# EAGLE design simhid-g1000_right (EAGLE 9.6.2)
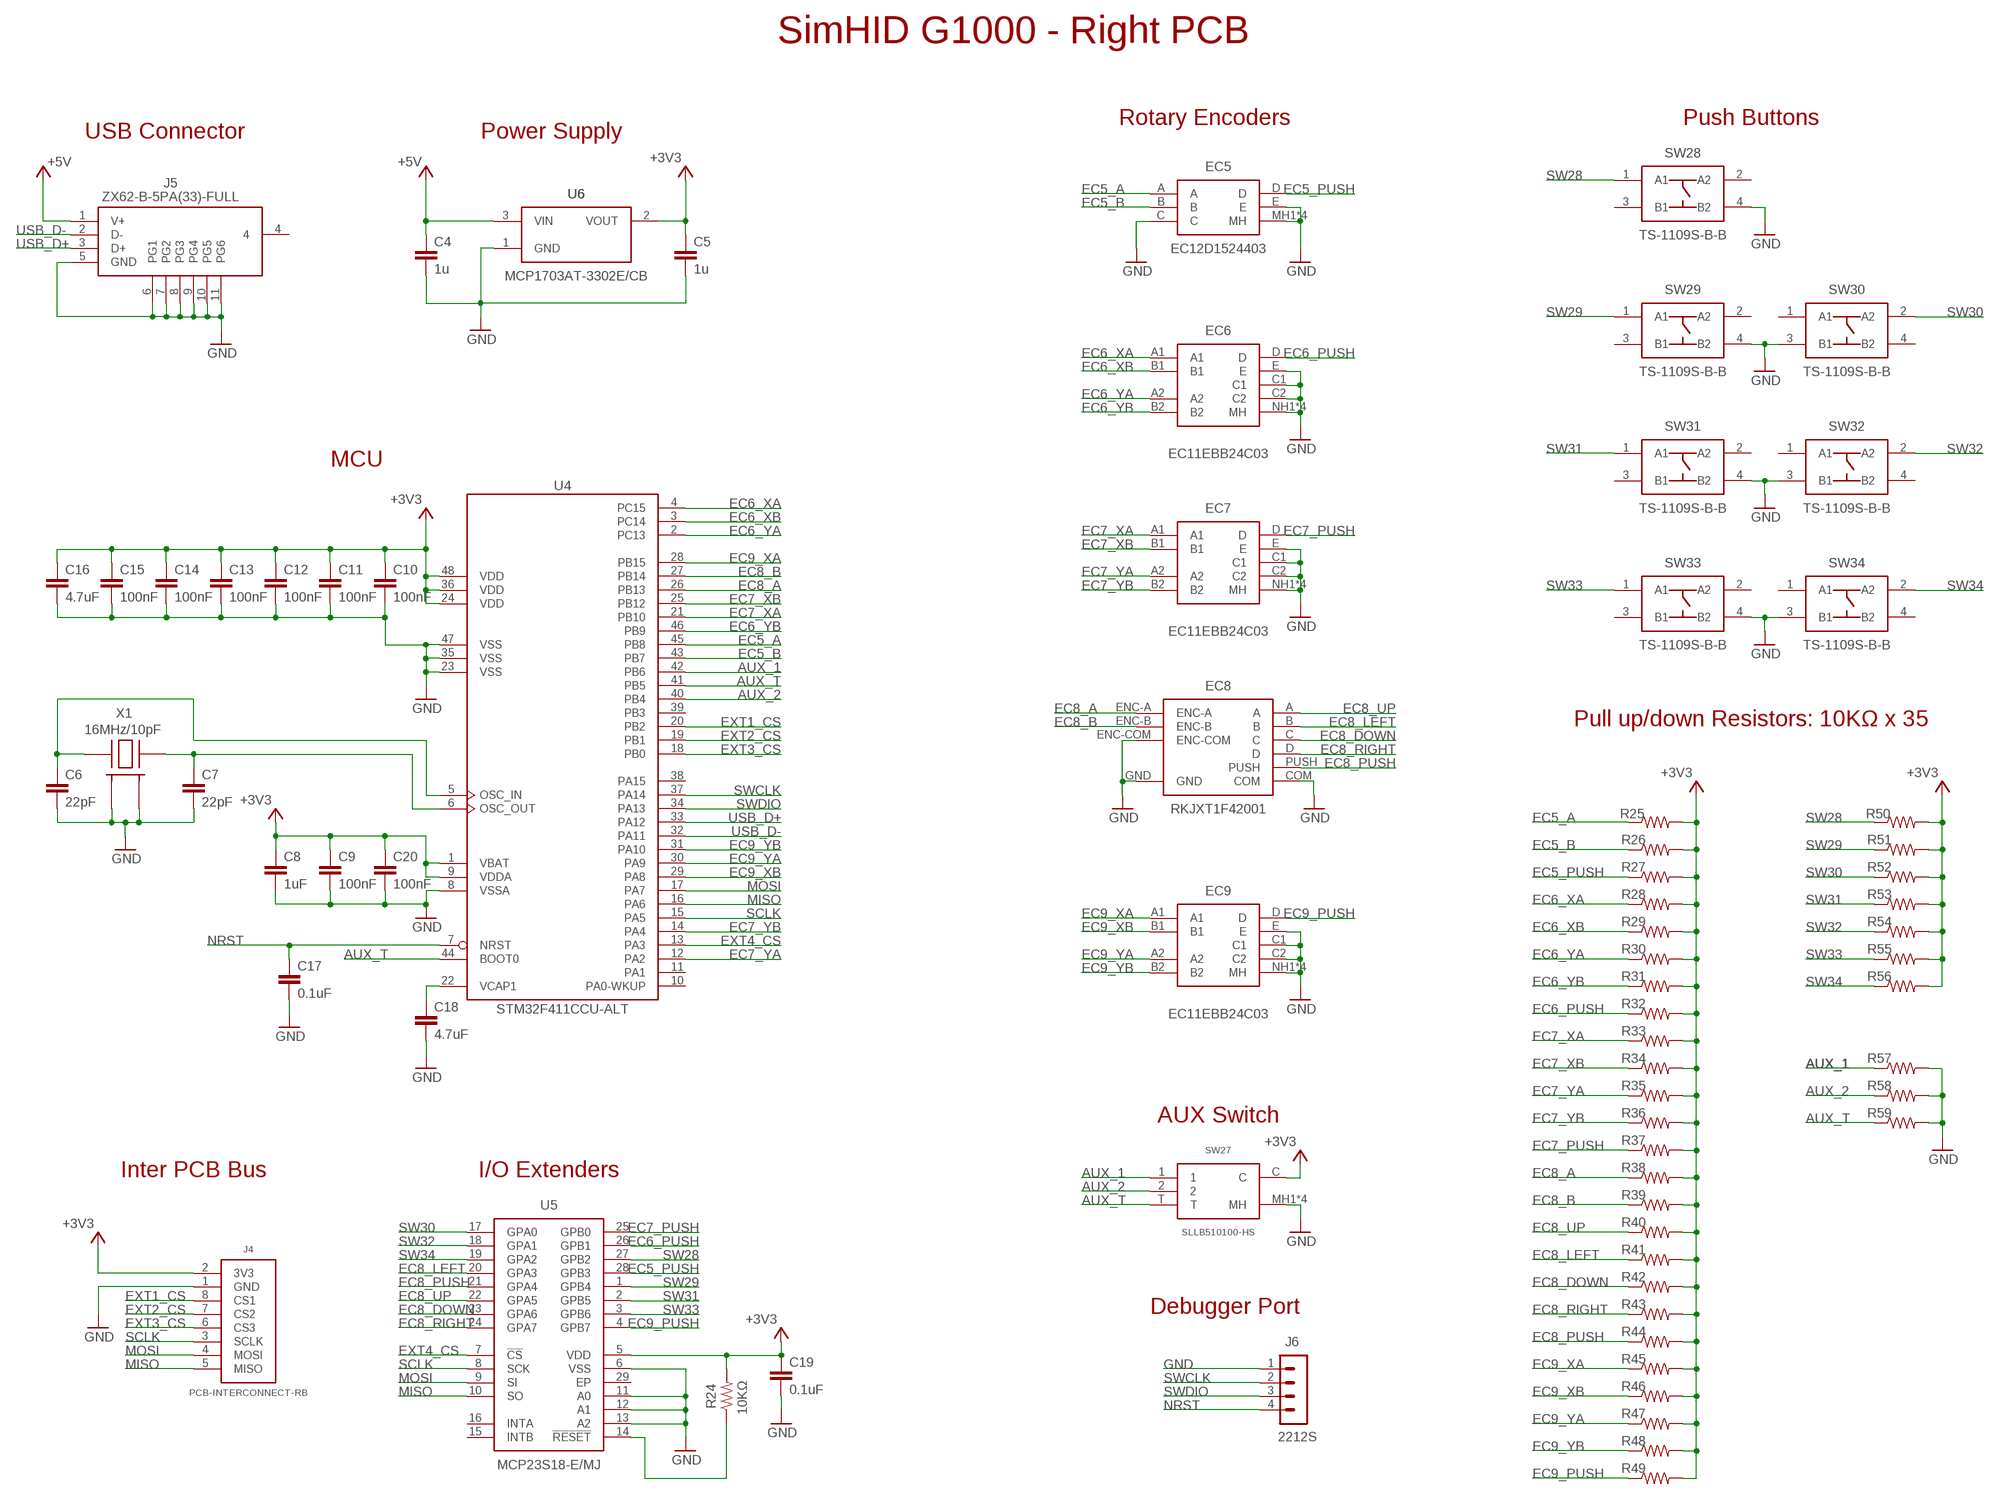
[diagram p0: schematic, sheet 1]

## Parts
C4  1u  RCL_C-EUC0402-HS  [RCL_C0402_HS]
C5  1u  RCL_C-EUC0402-HS  [RCL_C0402_HS]
C6  22pF  RCL_C-EUC0402-HS  [RCL_C0402_HS]
C7  22pF  RCL_C-EUC0402-HS  [RCL_C0402_HS]
C8  1uF  RCL_C-EUC0402-HS  [RCL_C0402_HS]
C9  100nF  RCL_C-EUC0402-HS  [RCL_C0402_HS]
C10  100nF  RCL_C-EUC0402-HS  [RCL_C0402_HS]
C11  100nF  RCL_C-EUC0402-HS  [RCL_C0402_HS]
C12  100nF  RCL_C-EUC0402-HS  [RCL_C0402_HS]
C13  100nF  RCL_C-EUC0402-HS  [RCL_C0402_HS]
C14  100nF  RCL_C-EUC0402-HS  [RCL_C0402_HS]
C15  100nF  RCL_C-EUC0402-HS  [RCL_C0402_HS]
C16  4.7uF  RCL_C-EUC0402-HS  [RCL_C0402_HS]
C17  0.1uF  RCL_C-EUC0402-HS  [RCL_C0402_HS]
C18  4.7uF  RCL_C-EUC0402-HS  [RCL_C0402_HS]
C19  0.1uF  RCL_C-EUC0402-HS  [RCL_C0402_HS]
C20  100nF  RCL_C-EUC0402-HS  [RCL_C0402_HS]
EC5  EC12D1524403  [EC12D1524403]
EC6  EC11EBB24C03  [EC11EBB24C03]
EC7  EC11EBB24C03  [EC11EBB24C03]
EC8  RKJXT1F42001  [RKJXT1F42001]
EC9  EC11EBB24C03  [EC11EBB24C03]
J4  PCB-INTERCONNECT-RB  [PCB-INTERCONNECT-R]
J5  ZX62-B-5PA(33)-FULL  [ZX62-B-5PA(33)-TRUE-HANDSOLD]
J6  2212S  53047-0410  [53047-0410]
R24  10KΩ  RCL_R-US_R0402-HS  [RCL_R0402_HS]
R25  RCL_R-US_R0402-HS  [RCL_R0402_HS]
R26  RCL_R-US_R0402-HS  [RCL_R0402_HS]
R27  RCL_R-US_R0402-HS  [RCL_R0402_HS]
R28  RCL_R-US_R0402-HS  [RCL_R0402_HS]
R29  RCL_R-US_R0402-HS  [RCL_R0402_HS]
R30  RCL_R-US_R0402-HS  [RCL_R0402_HS]
R31  RCL_R-US_R0402-HS  [RCL_R0402_HS]
R32  RCL_R-US_R0402-HS  [RCL_R0402_HS]
R33  RCL_R-US_R0402-HS  [RCL_R0402_HS]
R34  RCL_R-US_R0402-HS  [RCL_R0402_HS]
R35  RCL_R-US_R0402-HS  [RCL_R0402_HS]
R36  RCL_R-US_R0402-HS  [RCL_R0402_HS]
R37  RCL_R-US_R0402-HS  [RCL_R0402_HS]
R38  RCL_R-US_R0402-HS  [RCL_R0402_HS]
R39  RCL_R-US_R0402-HS  [RCL_R0402_HS]
R40  RCL_R-US_R0402-HS  [RCL_R0402_HS]
R41  RCL_R-US_R0402-HS  [RCL_R0402_HS]
R42  RCL_R-US_R0402-HS  [RCL_R0402_HS]
R43  RCL_R-US_R0402-HS  [RCL_R0402_HS]
R44  RCL_R-US_R0402-HS  [RCL_R0402_HS]
R45  RCL_R-US_R0402-HS  [RCL_R0402_HS]
R46  RCL_R-US_R0402-HS  [RCL_R0402_HS]
R47  RCL_R-US_R0402-HS  [RCL_R0402_HS]
R48  RCL_R-US_R0402-HS  [RCL_R0402_HS]
R49  RCL_R-US_R0402-HS  [RCL_R0402_HS]
R50  RCL_R-US_R0402-HS  [RCL_R0402_HS]
R51  RCL_R-US_R0402-HS  [RCL_R0402_HS]
R52  RCL_R-US_R0402-HS  [RCL_R0402_HS]
R53  RCL_R-US_R0402-HS  [RCL_R0402_HS]
R54  RCL_R-US_R0402-HS  [RCL_R0402_HS]
R55  RCL_R-US_R0402-HS  [RCL_R0402_HS]
R56  RCL_R-US_R0402-HS  [RCL_R0402_HS]
R57  RCL_R-US_R0402-HS  [RCL_R0402_HS]
R58  RCL_R-US_R0402-HS  [RCL_R0402_HS]
R59  RCL_R-US_R0402-HS  [RCL_R0402_HS]
SW27  SLLB510100-HS  [SLLB510100-HS]
SW28  TS-1109S-B-B  [TS-1109S-B-B]
SW29  TS-1109S-B-B  [TS-1109S-B-B]
SW30  TS-1109S-B-B  [TS-1109S-B-B]
SW31  TS-1109S-B-B  [TS-1109S-B-B]
SW32  TS-1109S-B-B  [TS-1109S-B-B]
SW33  TS-1109S-B-B  [TS-1109S-B-B]
SW34  TS-1109S-B-B  [TS-1109S-B-B]
U4  STM32F411CCU-ALT  [UFQFPN48-2]
U5  MCP23S18-E/MJ  MCP23S17-E_ML  [QFN65P600X600X100-29N]
U6  MCP1703AT-3302E/CB  LDO-REGULATOR  [SOT23]
X1  16MHz/10pF  CRYSTAL3225HS  [CRYSTAL3225-HS]

## Nets
+3V3 [pwr]: C5.1 C8.1 C9.1 C10.1 C11.1 C12.1 C13.1 C14.1 C15.1 C16.1 C19.1 C20.1 J4.2(3V3) R24.2 R25.2 R26.2 R27.2 R28.2 R29.2 R30.2 R31.2 R32.2 R33.2 R34.2 R35.2 R36.2 R37.2 R38.2 R39.2 R40.2 R41.2 R42.2 R43.2 R44.2 R45.2 R46.2 R47.2 R48.2 R49.2 R50.2 R51.2 R52.2 R53.2 R54.2 R55.2 R56.2 SW27.C U4.1(VBAT) U4.9(VDDA) U4.24(VDD) U4.36(VDD) U4.48(VDD) U5.5(VDD) U6.2(VOUT)
+5V [pwr]: C4.1 J5.1(V+) U6.3(VIN)
AUX_1: R57.1 SW27.1 U4.42(PB6)
AUX_2: R58.1 SW27.2 U4.40(PB4)
AUX_T: R59.1 SW27.T U4.41(PB5) U4.44(BOOT0)
EC5_A: EC5.A R25.1 U4.45(PB8)
EC5_B: EC5.B R26.1 U4.43(PB7)
EC5_PUSH: EC5.D R27.1 U5.28(GPB3)
EC6_PUSH: EC6.D R32.1 U5.26(GPB1)
EC6_XA: EC6.A1 R28.1 U4.4(PC15)
EC6_XB: EC6.B1 R29.1 U4.3(PC14)
EC6_YA: EC6.A2 R30.1 U4.2(PC13)
EC6_YB: EC6.B2 R31.1 U4.46(PB9)
EC7_PUSH: EC7.D R37.1 U5.25(GPB0)
EC7_XA: EC7.A1 R33.1 U4.21(PB10)
EC7_XB: EC7.B1 R34.1 U4.25(PB12)
EC7_YA: EC7.A2 R35.1 U4.12(PA2)
EC7_YB: EC7.B2 R36.1 U4.14(PA4)
EC8_A: EC8.ENC-A R38.1 U4.26(PB13)
EC8_B: EC8.ENC-B R39.1 U4.27(PB14)
EC8_DOWN: EC8.C R42.1 U5.23(GPA6)
EC8_LEFT: EC8.B R41.1 U5.20(GPA3)
EC8_PUSH: EC8.PUSH R44.1 U5.21(GPA4)
EC8_RIGHT: EC8.D R43.1 U5.24(GPA7)
EC8_UP: EC8.A R40.1 U5.22(GPA5)
EC9_PUSH: EC9.D R49.1 U5.4(GPB7)
EC9_XA: EC9.A1 R45.1 U4.28(PB15)
EC9_XB: EC9.B1 R46.1 U4.29(PA8)
EC9_YA: EC9.A2 R47.1 U4.30(PA9)
EC9_YB: EC9.B2 R48.1 U4.31(PA10)
EXT1_CS: J4.8(CS1) U4.20(PB2)
EXT2_CS: J4.7(CS2) U4.19(PB1)
EXT3_CS: J4.6(CS3) U4.18(PB0)
EXT4_CS: U4.13(PA3) U5.7(!CS)
GND [gnd]: C4.2 C5.2 C6.2 C7.2 C8.2 C9.2 C10.2 C11.2 C12.2 C13.2 C14.2 C15.2 C16.2 C17.2 C18.2 C19.2 C20.2 EC5.C EC5.E EC5.MH1(MH) EC5.MH2(MH) EC5.MH3(MH) EC5.MH4(MH) EC6.C1 EC6.C2 EC6.E EC6.NH1(MH) EC6.NH2(MH) EC6.NH3(MH) EC6.NH4(MH) EC7.C1 EC7.C2 EC7.E EC7.NH1(MH) EC7.NH2(MH) EC7.NH3(MH) EC7.NH4(MH) EC8.COM EC8.ENC-COM EC8.GND EC9.C1 EC9.C2 EC9.E EC9.NH1(MH) EC9.NH2(MH) EC9.NH3(MH) EC9.NH4(MH) J4.1(GND) J5.5(GND) J5.6(PG1) J5.7(PG2) J5.8(PG3) J5.9(PG4) J5.10(PG5) J5.11(PG6) J6.1 R57.2 R58.2 R59.2 SW27.MH1(MH) SW27.MH2(MH) SW27.MH3(MH) SW27.MH4(MH) SW28.4(B2) SW29.4(B2) SW30.3(B1) SW31.4(B2) SW32.3(B1) SW33.4(B2) SW34.3(B1) U4.8(VSSA) U4.23(VSS) U4.35(VSS) U4.47(VSS) U5.6(VSS) U5.11(A0) U5.12(A1) U5.13(A2) U6.1(GND) X1.2(GND_1) X1.4(GND_2)
MISO: J4.5(MISO) U4.16(PA6) U5.10(SO)
MOSI: J4.4(MOSI) U4.17(PA7) U5.9(SI)
N$1: R24.1 U5.14(!RESET)
NRST: C17.1 J6.4 U4.7(NRST)
OSC_IN: C6.1 U4.5(OSC_IN) X1.1(HOT_1)
OSC_OUT: C7.1 U4.6(OSC_OUT) X1.3(HOT_2)
SCLK: J4.3(SCLK) U4.15(PA5) U5.8(SCK)
SW28: R50.1 SW28.1(A1) U5.27(GPB2)
SW29: R51.1 SW29.1(A1) U5.1(GPB4)
SW30: R52.1 SW30.2(A2) U5.17(GPA0)
SW31: R53.1 SW31.1(A1) U5.2(GPB5)
SW32: R54.1 SW32.2(A2) U5.18(GPA1)
SW33: R55.1 SW33.1(A1) U5.3(GPB6)
SW34: R56.1 SW34.2(A2) U5.19(GPA2)
SWCLK: J6.2 U4.37(PA14)
SWDIO: J6.3 U4.34(PA13)
USB_D+: J5.3(D+) U4.33(PA12)
USB_D-: J5.2(D-) U4.32(PA11)
VCAP: C18.1 U4.22(VCAP1)
Unconnected: J5.4 SW28.2(A2) SW28.3(B1) SW29.2(A2) SW29.3(B1) SW30.1(A1) SW30.4(B2) SW31.2(A2) SW31.3(B1) SW32.1(A1) SW32.4(B2) SW33.2(A2) SW33.3(B1) SW34.1(A1) SW34.4(B2) U4.10(PA0-WKUP) U4.11(PA1) U4.38(PA15) U4.39(PB3) U5.15(INTB) U5.16(INTA) U5.29(EP)

## Notes on the sheet
- SimHID G1000 - Right PCB
- Rotary Encoders | Push Buttons
- USB Connector | Power Supply
- MCU
- Pull up/down Resistors: 10KΩ x 35
- AUX Switch
- Inter PCB Bus | I/O Extenders
- Debugger Port

## Library data of the parts
C4-C20 = gen-discrete3:RCL_C-EU: CAPACITOR, European symbol
EC5 = RotaryEncoder:EC12D1524403
EC6 EC7 EC9 = RotaryEncoder:EC11EBB24C03
EC8 = RotaryEncoder:RKJXT1F42001
J4 = SimHID-G1000:PCB-INTERCONNECT
J5 = ZX62-B-5PA(33):ZX62-B-5PA(33)-FULL
J6 = connector:53047-0410: HEADER
R24-R59 = gen-discrete3:RCL_R-US_: RESISTOR, American symbol
SW27 = Switches:SLLB510100
SW28-SW34 = Switches:TS-1109S-B-B
U4 = stm32:STM32F411CCU*
U5 = MCP23S17-E_ML:MCP23S17-E_ML: 16-Bit I/O Port Expander SPI 10M QFN28EP Microchip MCP23S17-E/ML, 16-channel 16bit I/O Expander 10MHz, Serial-SPI, 28-Pin QFN Source: Datasheet <http://docs-emea.rs-online.com/webdocs/1169/0900766b811692f9.pdf>; ARROW_PART_NUMBER: MCP23S17-E/ML; ARROW_PRICE-STOCK: https://www.arrow.com/en/products/mcp23s17-eml/microchip-technology; DESCRIPTION: 16-Bit I/O Port Expander SPI 10M QFN28EP Microchip MCP23S17-E/ML, 16-channel 16bit I/O Expander 10MHz, Serial-SPI, 28-Pin QFN; HEIGHT: 1mm; MANUFACTURER_NAME: Microchip; MANUFACTURER_PART_NUMBER: MCP23S17-E/ML; MOUSER_PART_NUMBER: 579-MCP23S17-E/ML; MOUSER_PRICE-STOCK: https://www.mouser.co.uk/ProductDetail/Microchip-Technology/MCP23S17-E-ML/?qs=usxtMOJb1RyqBjk32jXtPQ%3D%3D
U6 = SOT23_Module:LDO-REGULATOR
X1 = CRYSTAL3225:CRYSTAL3225: Crystals 3225

## Net classes
1 gnd: width 0.2 mm
2 pwr: width 0.2 mm

## Board
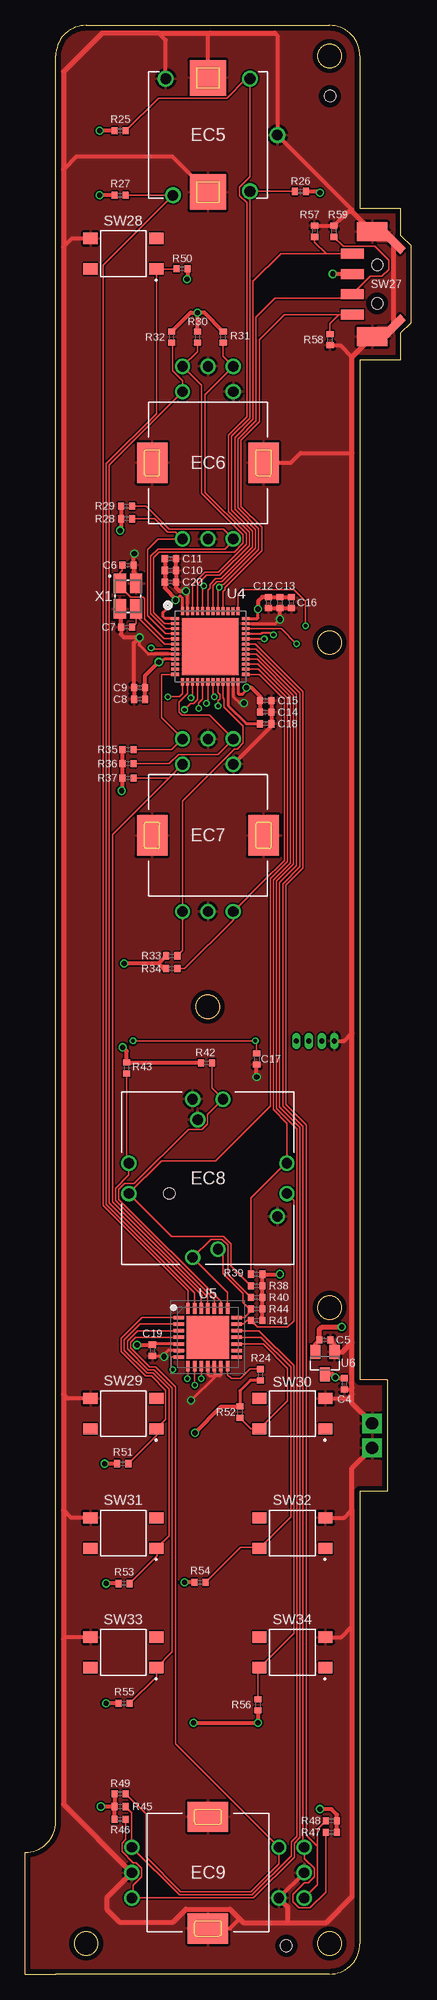
[diagram p1: board, top side]
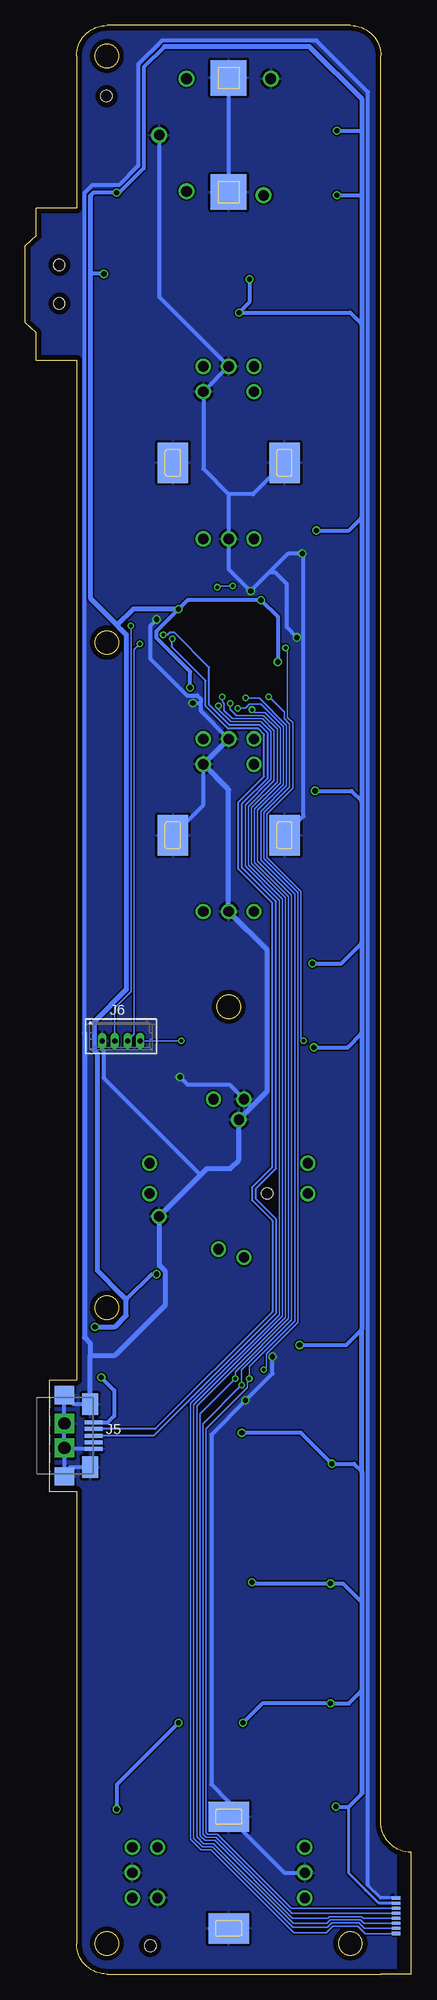
[diagram p2: board, bottom side, seen from below]

Size 38.05 x 192 mm. Coordinates in mm from the lower left corner, seen from the top.
Outline: 3,15 3,189 arc-90 6,192 30,192 arc-90 33,189 33,174 37,174 37,171.3 38.05,170.3 38.05,162.7 37,161.7 37,159 33,159 33,58.54 35.68,58.54 35.68,47.54 33,47.54 33,3 arc-90 30,0 3,0
Outline: 0,0 0,12
Outline: circle at 30,65.68 radius 1.15
Outline: circle at 30,3 radius 1.15
Outline: circle at 6,3 radius 1.15
Outline: circle at 30,131.19 radius 1.15
Outline: circle at 18,95.3 radius 1.15
Outline: circle at 30,189 radius 1.15
Copper layers (1*16): Top 0.035mm / dielectric 1mm / Bottom 0.035mm
Design rules "Elecrow_2-layer_PCB_eagle_rule *": minimum track width 6mil, minimum drill 12mil, track to track 6mil, track to pad 6mil, pad to pad 6mil, via to via 8mil, smd to smd 0mil, copper to edge 20mil, drill to drill 10mil, minimum pad ring 6mil, minimum via ring 6mil, stop-mask expansion 0mil, vias tented up to drill 100mil, thermal gap 10mil
Holes 2.3 mm at 30,189 30,131.19 18,95.3 30,65.68 30,3 6,3
Holes 1.15 mm at 30.05,185.04 25.73,2.79

### Footprints (pad centres in the part's own frame; a part is rotated, then mirrored left to right if it is on the bottom)
RCL_C0402_HS = smd 0.6 x 0.7: 1 -0.55,0; 2 0.55,0
EC12D1524403 = drill 1.05: A 5.55,-4.15; B -5.55,-4.15; C 5.55,4.15; D -5.95,3.45; E 0,-6.85 | smd 3.5 x 3.55: MH1 -5.625,0; MH3 5.625,0 | smd 3.5 x 3.55 bottom: MH2 -5.625,0; MH4 5.625,0
EC11EBB24C03 = drill 1: A1 2.5,7.5; A2 2.5,-9.5; B1 -2.5,7.5; B2 -2.5,-9.5; C1 0,7.5; C2 0,-9.5; D 2.5,-7; E -2.5,-7 | smd 3 x 4: NH1 5.5,0; NH3 -5.5,0 | smd 3 x 4 bottom: NH2 5.5,0; NH4 -5.5,0
RKJXT1F42001 = drill 1: A -1.5,-7.8; B 7.8,-1.5; C 1.5,7.8; COM -1,5.78; D -7.8,1.5; ENC-A -7.8,-1.5; ENC-B 7.8,1.5; ENC-COM -1.5,7.8; GND 6.86,-3.75; PUSH 1,-6.98 | hole 1.1: -3.8,-1.5
PCB-INTERCONNECT-R = smd 0.8 x 0.3: 1 1.5,7.5; 2 1.5,7; 3 1.5,6.5; 4 1.5,6; 5 1.5,5.5; 6 1.5,5; 7 1.5,4.5; 8 1.5,4
ZX62-B-5PA(33)-TRUE-HANDSOLD = smd 0.4 x 1.75: 1 -1.3,2.875; 2 -0.65,2.875; 3 0,2.875; 4 0.65,2.875; 5 1.3,2.875 | smd 2.1 x 1.6: 6 -3.1,2.55; 7 3.1,2.55 | drill 1.2 pad 1.9 square: 8 -1.2,0; 9 1.2,0 | smd 1.8 x 1.9: 10 -4,0; 11 4,0
53047-0410 = drill 0.508 long: 1 1.875,0; 2 0.625,0; 3 -0.625,0; 4 -1.875,0
RCL_R0402_HS = smd 0.6 x 0.7: 1 -0.55,0; 2 0.55,0
SLLB510100-HS = smd 1 x 2.3: 1 -3,-1.45; 2 3,-1.45; C -1,-1.45; T 1,-1.45 | smd 2.6 x 0.8 rotated 45: MH1 -4.172,2.616 | smd 2.6 x 0.8 rotated 315: MH2 4.172,2.616 | smd 1.85 x 3: MH3 -5.175,0.5; MH4 5.175,0.5 | hole 1.1: 1.9,1; -1.9,1
TS-1109S-B-B = smd 1.4 x 1.1: 1 -3.25,1.5; 2 3.25,1.5; 3 -3.25,-1.5; 4 3.25,-1.5
UFQFPN48-2 = smd 0.75 x 0.3: 1 -3.48,2.75; 2 -3.48,2.25; 3 -3.48,1.75; 4 -3.48,1.25; 5 -3.48,0.75; 6 -3.48,0.25; 7 -3.48,-0.25; 8 -3.48,-0.75; 9 -3.48,-1.25; 10 -3.48,-1.75; 11 -3.48,-2.25; 12 -3.48,-2.75; 25 3.48,-2.75; 26 3.48,-2.25; 27 3.48,-1.75; 28 3.48,-1.25; 29 3.48,-0.75; 30 3.48,-0.25; 31 3.48,0.25; 32 3.48,0.75; 33 3.48,1.25; 34 3.48,1.75; 35 3.48,2.25; 36 3.48,2.75 | smd 0.3 x 0.75: 13 -2.75,-3.48; 14 -2.25,-3.48; 15 -1.75,-3.48; 16 -1.25,-3.48; 17 -0.75,-3.48; 18 -0.25,-3.48; 19 0.25,-3.48; 20 0.75,-3.48; 21 1.25,-3.48; 22 1.75,-3.48; 23 2.25,-3.48; 24 2.75,-3.48; 37 2.75,3.48; 38 2.25,3.48; 39 1.75,3.48; 40 1.25,3.48; 41 0.75,3.48; 42 0.25,3.48; 43 -0.25,3.48; 44 -0.75,3.48; 45 -1.25,3.48; 46 -1.75,3.48; 47 -2.25,3.48; 48 -2.75,3.48 | smd 5.6 x 5.6: EXP 0,0
QFN65P600X600X100-29N = smd 1.05 x 0.35: 1 -2.85,1.95; 2 -2.85,1.3; 3 -2.85,0.65; 4 -2.85,0; 5 -2.85,-0.65; 6 -2.85,-1.3; 7 -2.85,-1.95; 15 2.85,-1.95; 16 2.85,-1.3; 17 2.85,-0.65; 18 2.85,0; 19 2.85,0.65; 20 2.85,1.3; 21 2.85,1.95 | smd 0.35 x 1.05: 8 -1.95,-2.85; 9 -1.3,-2.85; 10 -0.65,-2.85; 11 0,-2.85; 12 0.65,-2.85; 13 1.3,-2.85; 14 1.95,-2.85; 22 1.95,2.85; 23 1.3,2.85; 24 0.65,2.85; 25 0,2.85; 26 -0.65,2.85; 27 -1.3,2.85; 28 -1.95,2.85 | smd 4.2 x 4.2: 29 0,0
SOT23 = smd 1 x 1.4: 1 -0.95,-1.1; 2 0.95,-1.1; 3 0,1.1
CRYSTAL3225-HS = smd 1.9 x 1.2: 1 -1.26,-0.8; 2 1.26,-0.8; 3 1.26,0.8; 4 -1.26,0.8

### Placement (x,y rotation side)
C4  31.45,58.17 270 top
C5  29.54,62.48 0 top
C6  10.11,138.81 0 top
C7  9.98,132.72 180 top
C8  11.26,125.6 180 top
C9  11.26,126.75 180 top
C10  14.3,138.3 0 top
C11  14.3,139.45 0 top
C12  23.95,135.13 270 top
C13  25.1,135.13 270 top
C14  23.7,124.33 0 top
C15  23.7,125.48 0 top
C16  26.24,135.13 270 top
C17  22.81,90.17 270 top
C18  23.7,123.19 0 top
C19  12.53,61.47 270 top
C20  14.3,137.16 0 top
EC5  18,181.2 90 top
EC6  18,148.9 180 top
EC7  18,112.2 180 top
EC8  18,78.4 0 top
EC9  18,10 90 top
J4  3,0 0 bottom
J5  34.2,53.05 270 bottom
J6  28.6,91.94 180 bottom
R24  23.19,59.05 270 top
R25  9.35,181.61 180 top
R26  27.13,175.64 0 top
R27  9.35,175.26 180 top
R28  9.98,143.38 180 top
R29  9.98,144.65 180 top
R30  16.97,161.29 90 top
R31  19.51,161.29 90 top
R32  14.43,161.29 90 top
R33  14.43,100.33 180 top
R34  14.43,99.06 180 top
R35  10.11,120.65 180 top
R36  10.11,119.25 180 top
R37  10.11,117.86 180 top
R38  22.81,67.82 0 top
R39  22.81,68.96 0 top
R40  22.81,66.67 0 top
R41  22.81,64.39 0 top
R42  17.86,89.79 180 top
R43  9.98,89.28 90 top
R44  22.81,65.53 0 top
R45  9.35,16.51 180 top
R46  9.35,15.24 180 top
R47  30.18,13.97 0 top
R48  30.18,15.11 0 top
R49  9.35,17.78 180 top
R50  15.45,168.02 0 top
R51  9.6,50.29 180 top
R52  21.16,55.37 90 top
R53  9.73,38.48 180 top
R54  17.22,38.61 180 top
R55  9.73,26.67 180 top
R56  22.94,26.54 270 top
R57  28.53,171.7 90 top
R58  30.05,161.04 270 top
R59  30.43,171.7 90 top
SW27  33.7,166.5 270 top
SW28  9.67,169.5 180 top
SW29  9.67,55.22 180 top
SW30  26.33,55.22 180 top
SW31  9.67,43.46 180 top
SW32  26.33,43.46 180 top
SW33  9.67,31.7 180 top
SW34  26.33,31.7 180 top
U4  18.24,130.81 0 top
U5  17.99,62.74 0 top
U6  29.54,60.2 180 top
X1  10.11,135.76 270 top

### Tracks (layer width: path | path; a pad name or v marks a point on that pad's centre or on a via)
+3V3  (via drill 0.5)
  Top 0.3: U4.48 15.49,135.59 15.32,135.76 15.19,135.76 14.87,135.45 v14.81,135.38 13.57,134.15 13.57,133.76 13.78,133.56 U4.1 | U4.24 20.99,126.16 21.03,126.11 21.41,126.11 21.8,126.49 v21.8,126.75 | U4.9 13.69,129.56 13.41,129.29 v13.16,129.29 | U4.36 22.89,133.56 22.94,133.6 v22.94,134.49 | U5.5 12.6,62.09 C19.1 | R24.2 22.18,58.51 21.16,57.48 R52.2
  Top 0.4: v30.3,167.51 32.24,167.51 SW27.C | R25.2 v7.32,181.61 | R27.2 v7.32,175.26 | R26.2 28.91,175.64 v29.04,175.51 | R30.2 v16.97,163.7 | R32.2 16.29,163.7 v16.97,163.7 | R31.2 17.65,163.7 v16.97,163.7 | R33.2 13.12,99.57 | 13.12,99.57 v9.73,99.57 | R34.2 13.63,99.06 13.12,99.57 | R35.2 R36.2 R37.2 9.56,116.67 v9.48,116.59 | R41.2 R44.2 R40.2 R38.2 R39.2 v25.1,68.96 | R42.2 10.03,89.79 R43.2 9.98,90.93 v9.6,91.31 | R47.2 R48.2 30.73,15.71 30.18,16.26 v29.04,16.26 | R49.2 R45.2 | R46.2 R45.2 | R45.2 v7.45,16.51 | R50.2 16,167.05 v15.95,167 | R51.2 v7.83,50.29 | R54.2 v15.7,38.61 | R53.2 v7.95,38.48 | R55.2 v7.95,26.67 | R56.2 v22.94,24.77 v16.59,24.77 | C8.1 C9.1 11.8,127.93 v13.16,129.29 | R29.2 R28.2 9.44,142.32 v9.35,142.24 | C11.1 C10.1 C20.1 13.75,136.57 14.87,135.45 | v22.94,134.49 22.94,135.25 23.36,135.68 C12.1 C13.1 C16.1 | v21.8,126.75 22.3,126.75 23.15,125.9 C15.1 C14.1 | v11,61.98 12.48,61.98 C19.1 | v16.72,53.34 19.3,55.92 R52.2 | U6.2 28.59,62.08 C5.1
  Top 0.5: C5.1 28.99,63.5 29.25,63.75 v31.19,63.75
  Bottom 0.3: J4.2 3.19,7 4.45,8.26 4.48,8.26 6.14,9.93 6.14,16.51
  Bottom 0.4: v30.3,167.51 31.48,167.51 31.61,167.64 | 31.61,175.26 31.35,175.51 v29.04,175.51 28.78,175.51 26.37,177.93 26.37,187.87 24.34,189.9 | v7.32,175.26 4.87,175.26 | v7.32,181.61 4.87,181.61 | 4.87,162.56 6.01,163.7 v16.97,163.7 15.95,164.72 v15.95,167 | v9.48,116.59 5.89,116.59 4.87,115.57 | v25.1,68.96 25.6,68.96 28.09,66.47 | 9.48,91.44 v9.6,91.31 6.27,91.31 4.87,92.71 | v7.45,16.51 6.14,16.51 4.87,17.78 | 4.87,49.53 5.63,50.29 v7.83,50.29 10.87,53.34 v16.72,53.34 | v15.7,38.61 15.57,38.48 v7.95,38.48 6.73,38.48 5.08,36.83 4.87,36.83 | 4.87,27.94 6.14,26.67 v7.95,26.67 14.68,26.67 v16.59,24.77 | v9.35,142.24 6.14,142.24 4.87,143.51 | v21.8,126.75 21.8,128.32 25.14,131.67 25.14,132.29 v22.94,134.49 22.05,135.38 v14.81,135.38 13.16,133.73 v13.16,129.29 | v11,61.98 6.4,61.98 4.87,63.5 | v9.73,99.57 6.9,99.57 4.87,101.6 | v22.94,24.77 29.04,18.67 v29.04,16.26
  Bottom 0.5: 28.99,132.89 28.59,132.49 28.59,132.48 28.09,131.98 28.09,97 31.28,93.81 31.28,91.02 30.94,90.68 30.94,69.32 28.59,66.98 28.59,66.97 28.09,66.47 28.09,64.89 28.59,64.39 28.65,64.32 28.71,64.27 29.21,63.77 31.18,63.77 v31.19,63.75 | 28.99,132.89 31.61,135.51 31.61,167.64 31.61,175.26 | 24.34,189.9 10.02,189.9 4.87,184.75 4.87,181.61 4.87,175.26 4.87,162.56 4.87,143.51 4.87,115.57 4.87,101.6 4.87,92.71 4.87,63.5 4.87,49.53 4.87,36.83 4.87,27.94 4.87,17.78 | v22.94,134.49 27.38,134.49 28.99,132.89
+5V  (via drill 0.5)
  Top 0.4: C4.1 30.64,58.72 v30.56,58.8
  Top 0.5: v30.56,58.8 30.26,59.1 U6.3 29.37,58.93
  Bottom 0.4: J5.1 29.93,54.35 29.29,54.99 29.29,57.53 v30.56,58.8
AUX_1
  Top 0.152: SW27.1 29.67,169.5 | 29.67,169.5 25.18,169.5 22.45,166.78 22.45,153.19 20.65,151.38 20.65,144.36 22.7,142.31 22.7,140.49 19.41,137.21 18.9,137.21 18.49,136.8 U4.42 | R57.1 28.53,170.64 29.67,169.5
AUX_2
  Top 0.152: SW27.2 30.94,163.5 | 30.94,163.5 25.53,163.5 23.06,161.03 23.06,152.93 21.26,151.13 21.26,144.61 23.31,142.56 23.31,140.24 19.68,136.62 19.68,136.42 19.49,136.23 U4.40 | R58.1 30.05,162.61 30.94,163.5
AUX_T  (via drill 0.35)
  Top 0.152: U4.44 17.49,136.66 v17.61,136.78 | U4.41 18.99,136.51 v19.13,136.65 19.38,136.9 19.54,136.9 23,140.36 23,142.44 20.96,144.48 20.96,151.26 22.76,153.06 22.76,163.27 24.59,165.1 31.85,165.1 SW27.T 34.02,167.27 35.17,167.27 35.83,167.93 35.83,168.87 34.48,170.23 31.36,170.23 R59.1
  Bottom 0.152: v17.61,136.78 19,136.78 v19.13,136.65
EC5_A
  Top 0.152: EC5.A 22.15,186.69 | 22.15,186.69 22.15,177.09 21.13,176.07 21.13,175.23 21.84,174.52 21.84,153.44 20.04,151.64 20.04,144.1 22.09,142.06 22.09,140.74 19.16,137.82 17.86,137.82 16.99,136.95 U4.45 | 22.15,186.69 21.71,186.69 19.87,184.85 13.14,184.85 R25.1
EC5_B
  Top 0.152: U4.43 17.99,136.38 18.18,136.57 18.18,136.93 18.77,137.51 19.29,137.51 22.39,140.62 22.39,142.19 20.35,144.23 20.35,151.51 22.15,153.31 EC5.B R26.1
EC5_PUSH
  Top 0.152: EC5.D 14.49,175.19 | 14.49,175.19 7.67,168.37 7.67,75.72 16.04,67.35 U5.28 | R27.1 14.43,175.26 14.49,175.19
EC6_PUSH
  Top 0.152: R32.1 14.52,160.65 14.52,158 15.5,157.02 EC6.D 8.28,148.68 8.28,77.47 8.28,77.27 8.28,75.97 17.4,66.86 17.4,66.67 17.34,66.61 U5.26
EC6_XA
  Top 0.152: R28.1 12.73,143.38 14.04,142.07 14.83,142.07 EC6.A1 13.08,141.4 12.04,140.36 12.04,133.83 13.81,132.06 U4.4
EC6_XB
  Top 0.152: R29.1 11.89,144.65 14.16,142.38 19.52,142.38 EC6.B1 20.5,141.25 19.67,140.42 13.07,140.42 12.35,139.7 12.35,134.02 13.81,132.56 U4.3
EC6_YA
  Top 0.152: R30.1 16.97,159.87 EC6.A2 17.35,156.55 17.35,145.93 21.48,141.81 21.48,141 20.6,140.12 13.2,140.12 12.65,139.57 12.65,134.15 13.74,133.06 U4.2
EC6_YB
  Top 0.152: U4.46 16.49,136.88 17.73,138.12 19.04,138.12 21.78,140.87 21.78,141.93 17.73,145.98 17.73,155.63 EC6.B2 19.51,159.39 R31.1
EC7_PUSH
  Top 0.152: EC7.D 14.15,117.86 | 14.15,117.86 8.59,112.29 8.59,76.1 17.99,66.7 U5.25 | R37.1 14.15,117.86
EC7_XA
  Top 0.152: R33.1 15.5,100.85 EC7.A1 15.5,115.58 20.64,120.72 20.91,120.72 21.48,121.3 21.48,122.97 19.61,124.84 19.61,125.63 19.49,125.75 U4.21
EC7_XB
  Top 0.152: R34.1 15.7,99.06 20.5,103.86 EC7.B1 23.44,107.64 23.45,107.64 25.53,109.73 25.53,125.6 23.07,128.06 U4.25
EC7_YA
  Top 0.152: 15.5,121.72 EC7.A2 | R35.1 14.43,120.65 15.5,121.72 | U4.12 13.46,128.06 13.41,128.02 13.41,123.81 15.5,121.72
EC7_YB
  Top 0.152: R36.1 14.17,119.25 15.1,120.18 18.98,120.18 EC7.B2 18.17,124.03 15.47,124.03 15.14,124.36 15.14,125.33 15.99,126.17 U4.14
EC8_A
  Top 0.152: R38.1 20.28,69.8 20.28,71.95 19.53,72.7 14.4,72.7 EC8.ENC-A 13.44,80.14 18.75,80.14 24.16,85.55 24.16,107.92 25.84,109.61 25.84,125.72 23,128.56 U4.26
EC8_B
  Top 0.152: 25.8,80.01 25.8,83.83 24.46,85.17 24.46,107.8 26.14,109.48 26.14,125.85 22.93,129.06 U4.27 | 25.8,80.01 EC8.ENC-B | R39.1 22.26,76.47 25.8,80.01
EC8_DOWN
  Top 0.152: R42.1 18.41,87.29 EC8.C 17.98,84.68 17.98,83.78 17.41,83.2 16.07,83.2 10.75,77.88 9.79,77.88 9.22,77.31 9.22,76.33 19.29,66.26 U5.23
EC8_LEFT
  Top 0.152: EC8.B 26.47,76.23 26.47,64.37 25.86,63.75 22.9,63.75 R41.1 21.84,64.39 21.49,64.04 U5.20
EC8_PUSH
  Top 0.152: EC8.PUSH 19.49,70.93 19.49,69.02 21.46,67.04 21.46,66.17 22.1,65.53 R44.1 22.26,65.36 21.73,64.83 21.73,64.79 21.64,64.69 U5.21
EC8_RIGHT
  Top 0.152: R43.1 9.98,80.12 EC8.D 10.2,78.72 8.92,77.43 8.92,76.2 18.64,66.48 U5.24
EC8_UP
  Top 0.152: R40.1 19.98,68.96 19.98,71.83 19.41,72.4 18.3,72.4 EC8.A 19.94,67.17 U5.22
EC9_PUSH
  Top 0.152: R49.1 11.89,15.79 11.89,11.54 15.32,8.11 22.24,8.11 25,10.87 EC9.D 14.81,22.69 14.81,57.86 12.82,59.84 12.24,59.84 10.37,61.72 10.37,62.24 10.87,62.74 U5.4
EC9_XA
  Top 0.152: R45.1 10.5,15.91 EC9.A1 15.2,7.8 22.36,7.8 26.22,11.66 26.22,13.03 26.78,13.59 26.78,83.28 24.77,85.29 24.77,107.67 26.45,109.35 26.45,125.98 22.86,129.56 U4.28
EC9_XB
  Top 0.152: EC9.B1 10.62,7.5 | 10.62,7.5 22.49,7.5 26.52,11.53 26.52,12.9 27.08,13.47 27.08,83.41 25.07,85.42 25.07,107.55 26.75,109.23 26.75,126.11 22.8,130.06 U4.29 | R46.1 9.9,13.28 9.52,12.9 9.52,12.1 10.64,10.98 10.9,10.98 11.48,10.4 11.48,9.6 10.62,8.74 10.62,7.5
EC9_YA
  Top 0.152: R47.1 29.63,8.09 28.06,6.52 26.96,6.52 26.37,7.11 26.37,7.87 27.52,9.02 27.91,9.02 28.48,9.6 28.48,10.4 27.5,11.38 EC9.A2 27.39,12.61 27.39,83.53 25.38,85.55 25.38,107.42 27.06,109.1 27.06,126.23 22.73,130.56 U4.30
EC9_YB
  Top 0.152: 28.78,12.6 28.78,8.78 EC9.B2 | 28.78,12.6 27.69,13.69 27.69,83.66 25.68,85.67 25.68,107.29 27.36,108.97 27.36,126.37 22.67,131.06 U4.31 | R48.1 28.78,14.27 28.78,12.6
EXT1_CS  (via drill 0.35)
  Top 0.152: U4.20 18.99,126.27 19.18,126.09 19.18,125.63 19,125.45 v19,124.97
  Bottom 0.152: v19,124.97 19,124.61 17.77,123.38 14.8,123.38 13.82,122.4 13.82,117.72 16.36,115.18 16.36,109.15 13.01,105.8 13.01,64.97 21.75,56.23 21.75,13.27 20.73,12.25 19.74,12.25 11.55,4.06 8.38,4.06 7.71,4.73 5.27,4.73 4.54,4 J4.8
EXT2_CS  (via drill 0.35)
  Top 0.152: U4.19 18.49,125.99 v18.62,125.86
  Bottom 0.152: v18.62,125.86 18.62,125.37 18.45,125.2 18.45,124.49 17.65,123.69 14.68,123.69 13.51,122.53 13.51,117.6 16.06,115.05 16.06,109.28 12.7,105.92 12.7,64.85 21.45,56.1 21.45,13.4 20.6,12.55 19.61,12.55 11.65,4.6 8.28,4.6 7.84,5.04 5.15,5.04 4.61,4.5 J4.7
EXT3_CS  (via drill 0.35)
  Top 0.152: U4.18 17.99,125.35 v17.86,125.22
  Bottom 0.152: v17.86,125.22 17.86,124.63 17.22,123.99 14.55,123.99 13.21,122.65 13.21,117.47 15.75,114.93 15.75,109.4 12.4,106.05 12.4,64.72 21.14,55.98 21.14,13.53 20.47,12.86 19.48,12.86 11.63,5 8.31,5 7.96,5.34 5.02,5.34 4.68,5 J4.6
EXT4_CS  (via drill 0.35)
  Top 0.152: U4.13 15.49,126.16 15.19,125.86 v14.05,125.86 | U5.7 14.43,60.79 14.35,60.71 14.35,59.77 v14.56,59.56
  Bottom 0.152: v14.05,125.86 12.52,124.33 12.52,123.69 11.99,123.16 11.99,116.97 14.53,114.42 14.53,109.91 11.18,106.55 11.18,64.22 14.3,61.09 14.3,59.82 v14.56,59.56
GND  (via drill 0.5)
  Top 0.2: SW27.MH3 34.82,171.68 36.32,170.18
  Top 0.3: U4.35 24.68,133.06 v25.1,133.48 | U4.47 15.99,136.11 v15.83,136.27 | U4.23 20.49,125.89 21.16,125.22 v21.54,125.22 | U4.8 12.67,130.06 12.66,130.05 12.14,130.05 11.26,130.94 v11.26,131.7 | U5.6 14.07,61.44 13.67,61.04 v13.67,60.83 13.58,60.92 C19.2 | U5.12 18.64,58.93 | 18.64,58.93 18.64,58.82 v16.34,56.52 | U5.11 18.03,59.84 18.03,59.05 18.16,58.93 18.64,58.93 | U5.13 19.3,59.87 19.3,59.05 19.18,58.93 18.64,58.93
  Top 0.4: EC5.C 13.85,190.55 13.16,191.24 | J6.1 31.45,91.94 32.21,92.71 | SW28.4 4.58,171 3.76,170.18 | SW29.4 4.19,56.72 3.76,57.15 | SW31.4 4.52,44.96 3.76,45.72 | SW33.4 3.94,33.2 3.76,33.02 | SW34.3 31.15,33.2 32.24,34.29 | SW32.3 31.45,44.96 32.21,45.72 | SW30.3 31.78,56.72 32.21,57.15 | EC9.E EC9.C2 | R57.2 R59.2 31.84,173.66 32.21,173.66 32.21,173.84 EC5.E 24.85,190.98 24.59,191.24 | R58.2 31.06,160.49 32.21,159.34 | X1.2 9.44,134.38 C7.2 9.44,132 9.73,131.7 v11.26,131.7 10.71,131.15 C9.2 C8.2 | C19.2 12.7,60.92 | v22.81,88.39 C17.2 | X1.4 10.91,137.88 10.66,138.13 C6.2 10.66,139.87 v10.75,139.95 | C11.2 C10.2 C20.2 14.85,136.61 15.19,136.27 v15.83,136.27 | C12.2 C13.2 | C15.2 C14.2 C18.2 24.25,122.95 EC7.E | v25.1,133.48 C13.2 | C13.2 C16.2 | EC5.MH3 18,191 18.24,191.24 | EC5.MH2 14.51,179.07 5.03,179.07 3.76,177.8 | EC6.NH3 26.17,148.9 27.13,149.86 32.21,149.86 | EC9.NH3 20.2,4.5 21.14,5.43 | U6.1 30.49,62.08 C5.2 | C4.2 32.04,57.62 32.21,57.78
  Top 0.5: J5.8 32.21,56.24 32.21,57.15 32.21,57.78 32.21,62.23 | SW27.MH4 32.21,159.34 32.21,149.86 32.21,92.71 32.21,62.23 | SW27.MH2 36.32,170.18 SW27.MH1 | SW27.MH3 32.21,173.66 | 24.59,191.24 18.24,191.24 13.16,191.24 7.55,191.24 3.76,187.45 3.76,177.8 3.76,170.18 3.76,57.15 3.76,45.72 3.76,33.02 3.76,16.74 EC9.C1 8.08,7.58 8.08,6.35 9.35,5.08 14.51,5.08 15.83,6.4 20.17,6.4 21.14,5.43 21.49,5.08 25.86,5.08 | 25.86,5.08 25.86,6.64 EC9.E | 25.86,5.08 29.67,5.08 32.24,7.65 32.24,34.29 32.24,45.69 32.21,45.72 32.21,49.86 J5.9 | U6.1 31.28,61.3 32.21,62.23
  Bottom 0.3: J4.1 3.01,7.5 4.27,8.76
  Bottom 0.4: J5.5 34.1,51.75 J5.9 | J5.9 34.2,49.4 | 34.2,49.4 J5.11 | J5.7 33.65,49.95 34.2,49.4 | J5.9 J5.8 J5.10 33.3,56.15 J5.6 | 4.27,8.76 4.27,185.42 9.35,190.5 24.59,190.5 26.92,188.17 26.92,178.16 28.81,176.27 31.45,176.27 32.21,175.51 32.21,92.71 | EC7.C2 20.72,124.42 20.72,125.39 | EC5.E 24.85,165.25 EC6.C2 EC6.E 20.5,148.31 18,145.81 | 18,145.81 EC6.C1 18,138.44 v15.83,136.27 13.98,138.12 | 13.98,138.12 13.41,138.12 12.27,136.97 12.27,132.72 v11.26,131.7 | v21.54,125.22 20.89,125.22 20.72,125.39 | 15.9,85.28 15.9,85.6 EC8.ENC-COM 17.93,87.63 22.05,87.63 v22.81,88.39 | J6.1 30.48,91.06 30.34,90.92 30.34,88.3 20.78,78.74 | 13.98,138.12 12.14,139.95 v10.75,139.95 10.62,139.83 10.62,114.08 EC7.NH2 | 20.72,125.39 20.72,125.61 21.1,125.99 22.11,125.99 25.7,129.58 25.7,132.88 v25.1,133.48 | EC6.NH2 15.59,145.81 18,145.81 | EC5.MH3 EC5.MH2 | EC7.NH3 20.5,115.2 EC7.E | EC9.C1 12.5,10 EC9.NH2 18,16.98 19.71,18.69 19.71,53.14 v16.34,56.52 13.67,59.18 v13.67,60.83 | EC9.NH3 18.24,4.26
  Bottom 0.5: 32.21,92.71 32.21,62.72 31.65,62.16 31.65,60.96 | EC7.C2 EC7.E 18,116.7 EC7.C1 14.19,100.89 14.19,86.99 15.9,85.28 EC8.COM 17,80.23 17.86,79.38 20.14,79.38 20.78,78.74 EC8.GND 24.86,69.86 24.29,69.29 24.29,65.88 29.21,60.96 31.65,60.96 | J5.6 31.65,60.96
  pour Top: -0.81,193.04 39.83,193.04 39.83,-1.27 -0.81,-1.27
  pour Bottom: 1.48,194.31 41.1,194.31 41.1,-2.54 1.48,-2.54
MISO  (via drill 0.35)
  Top 0.152: v15.7,124.59 16.29,125.17 16.57,125.17 16.99,125.6 U4.16 | U5.10 17.35,59.87 v17.35,58.67
  Bottom 0.152: v15.7,124.59 15.41,124.3 14.42,124.3 12.9,122.78 12.9,117.35 15.45,114.8 15.45,109.53 12.09,106.17 12.09,64.59 17.35,59.34 v17.35,58.67 20.84,55.19 20.84,13.65 20.35,13.16 19.36,13.16 11.7,5.5 8.24,5.5 8.09,5.65 4.89,5.65 4.75,5.5 J4.5
MOSI  (via drill 0.35)
  Top 0.152: v17.1,124.71 17.1,125.25 17.49,125.64 U4.17 | U5.9 16.69,58.07 v16.72,58.04
  Bottom 0.152: v17.1,124.71 16.36,124.71 15.93,125.14 14.84,125.14 12.6,122.9 12.6,117.22 15.14,114.67 15.14,109.66 11.79,106.3 11.79,64.47 16.72,59.54 v16.72,58.04 20.53,54.22 20.53,13.78 20.22,13.47 19.23,13.47 11.77,6 J4.4
N$1
  Top 0.152: U5.14 19.94,59.06 20.32,58.67 21.21,58.67 22.14,59.6 R24.1
NRST  (via drill 0.35)
  Top 0.152: v12.4,130.68 12.52,130.56 U4.7 | v10.62,91.95 v22.68,91.95 22.81,91.82 C17.1
  Bottom 0.152: J6.4 v22.69,91.94 v22.68,91.95 | v10.62,91.95 10.87,92.2 10.87,106.68 14.23,110.03 14.23,114.3 14.1,114.43 14.09,114.43 11.79,116.74 11.68,116.84 11.68,123.29 12.21,123.82 12.21,130.5 v12.4,130.68
OSC_IN
  Top 0.152: U4.5 13.68,131.56 11.74,133.5 11.74,135.55 11.61,135.68 10.38,135.68 9.54,136.53 9.54,136.97 9.31,136.75 X1.1 9.31,138.01 9.56,138.26 C6.1
OSC_OUT
  Top 0.152: X1.3 10.91,133.86 | 10.91,133.86 10.91,133.09 C7.1 | U4.6 13.71,131.06 10.91,133.86
SCLK  (via drill 0.35)
  Top 0.152: v15.95,58.68 v15.95,58.67 16.04,58.76 U5.8 | U4.15 16.49,125.89 v16.34,125.73
  Bottom 0.152: v16.34,125.73 14.99,125.73 12.29,123.03 12.29,117.09 14.84,114.55 14.84,109.78 11.48,106.43 11.48,64.34 15.95,59.87 v15.95,58.67 16.16,58.47 16.16,57.81 20.23,53.74 20.23,13.9 20.09,13.77 19.11,13.77 11.83,6.5 J4.3
SW28
  Top 0.152: R50.1 14.88,168 SW28.1 12.92,153.75 7.98,148.81 7.98,77.47 7.98,77.14 7.98,75.84 16.69,67.13 U5.27
SW29
  Top 0.152: R51.1 12.92,53.05 SW29.1 13.85,54.65 13.85,57.53 12.45,58.93 11.86,58.93 9.46,61.34 9.46,62.62 11.53,64.69 U5.1
SW30
  Top 0.152: R52.1 22.26,53.72 SW30.2 25.86,56.5 25.86,59.69 23.46,62.09 U5.17
SW31
  Top 0.152: 13.01,42.06 14.15,43.19 14.15,57.15 14.15,57.66 12.57,59.23 11.99,59.23 9.76,61.46 9.76,62.49 11.31,64.04 U5.2 | 13.01,42.06 SW31.1 | R53.1 13.01,41.21 13.01,42.06
SW32
  Top 0.152: SW32.2 23.18,42.05 | 23.18,42.05 26.17,45.05 26.17,59.82 23.25,62.74 U5.18 | R54.1 21.22,42.05 23.18,42.05
SW33
  Top 0.152: R55.1 12.92,29.31 SW33.1 14.46,31.74 14.46,57.78 12.7,59.54 12.12,59.54 10.06,61.59 10.06,62.36 11.09,63.39 U5.3
SW34
  Top 0.152: R56.1 22.94,30.06 SW34.2 26.47,33.59 26.47,59.97 23.05,63.39 U5.19
SWCLK  (via drill 0.35)
  Top 0.152: U4.37 20.99,135.97 21.41,136.4 26.49,136.4 27.64,135.25 v27.64,132.84
  Bottom 0.152: J6.2 29.23,95.19 27.61,96.8 27.61,132.82 v27.64,132.84
SWDIO  (via drill 0.35)
  Top 0.152: v26.75,131.06 25.25,132.56 U4.34
  Bottom 0.152: J6.3 27.36,92.56 27.36,92.61 27.31,92.67 27.31,130.5 v26.75,131.06
USB_D+  (via drill 0.35)
  Top 0.2: U4.33 23.24,132.06 23.33,132.15 24.26,132.15 v24.46,131.95
  Bottom 0.2: v24.46,131.95 24.01,131.95 23.81,132.15 23.33,132.15 19.92,128.74 19.92,125.06 17.91,123.06 14.94,123.06 14.14,122.26 14.14,117.86 16.69,115.32 16.69,109.02 13.34,105.66 13.34,79.4 15.36,77.38 15.36,76.42 13.34,74.4 13.34,65.11 25.39,53.05 J5.3
USB_D-  (via drill 0.35)
  Top 0.2: U4.32 v23.56,131.56 v23.57,131.57
  Bottom 0.2: v23.57,131.57 23.57,130.74 20.27,127.44 20.27,124.92 18.06,122.7 15.09,122.7 14.5,122.12 14.5,118.01 17.04,115.46 17.04,108.87 13.69,105.51 13.69,79.55 15.71,77.53 15.71,76.28 13.69,74.25 13.69,65.25 25.24,53.7 J5.2
VCAP
  Top 0.3: U4.22 19.99,125 21.8,123.19 C18.1